# Altium schematic sheet 09-LogicNOR.SchDoc
size A4
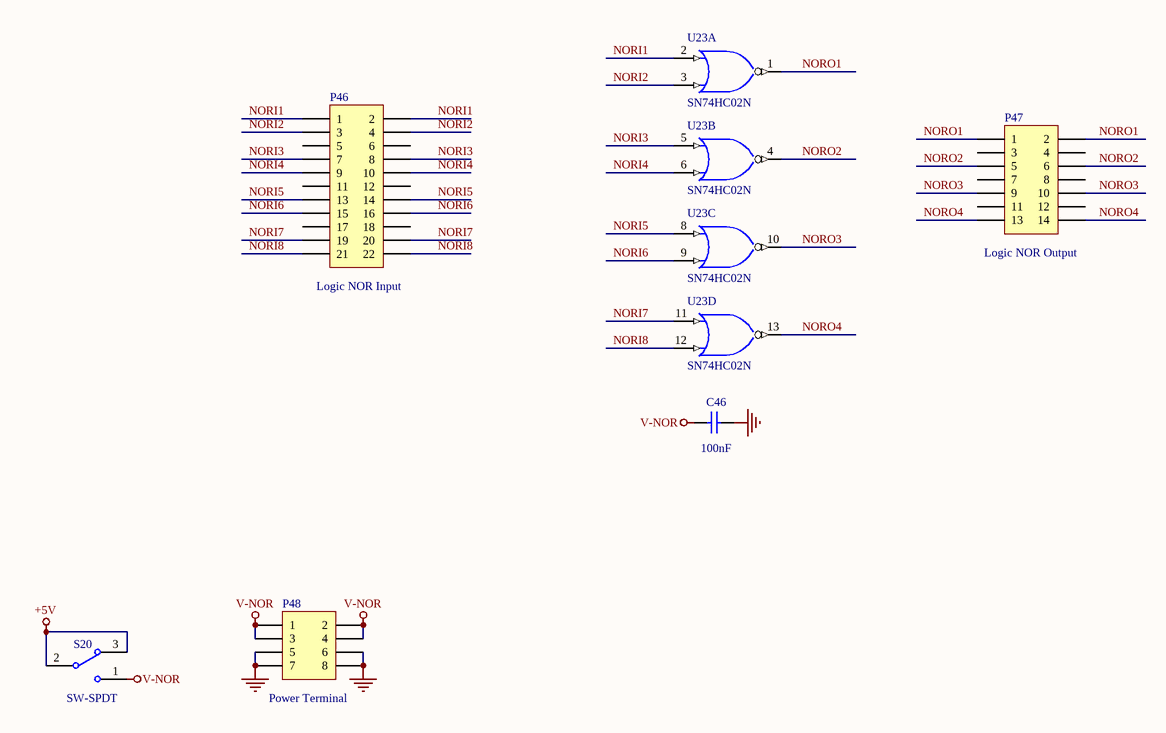
[diagram p0: 09-LogicNOR.SchDoc]

## Parts
C46  value 100nF  [C-0805]  (hidden comment: 104)
P46  value Logic NOR Input  [HDR2X11]  (hidden comment: Header 11X2)
P47  value Logic NOR Output  [HDR2X7]  (hidden comment: H7X2)
P48  Publisher: Power Terminal  [HDR2X4]  (hidden comment: Header 4X2)
S20  SW-SPDT  [SW-DIP1SMD]
U23  SN74HC02N  [SK-DIP14-300]  (parts A,B,C,D of 4)

## Nets
+5V: S20.2 S20.3
GND: C46.2 P48.5 P48.6 P48.7 P48.8 U23.7(GND)
V-NOR: C46.1 P48.1 P48.2 P48.3 P48.4 S20.1
VCC: U23.14(V-NOR)
NORI1: P46.1 P46.2 U23.2(A)
NORI2: P46.3 P46.4 U23.3(B)
NORI3: P46.7 P46.8 U23.5(A)
NORI4: P46.9 P46.10 U23.6(B)
NORI5: P46.13 P46.14 U23.8(A)
NORI6: P46.15 P46.16 U23.9(B)
NORI7: P46.19 P46.20 U23.11(A)
NORI8: P46.21 P46.22 U23.12(B)
NORO1: P47.1 P47.2 U23.1(Y)
NORO2: P47.5 P47.6 U23.4(Y)
NORO3: P47.9 P47.10 U23.10(Y)
NORO4: P47.13 P47.14 U23.13(Y)

Not connected (* = marked no-connect by the designer): P46 5 6 11 12 17 18; P47 3 4 7 8 11 12

## Library data of the parts
C46 = Cap: Capacitor; Published: 8-Jun-2000; LatestRevisionDate: 17-Jul-2002; LatestRevisionNote: Re-released for DXP Platform.; PackageReference: RAD-0.3; Publisher: Altium Limited; PackageDescription: Radial Cap, Thru-Hole; 2 Leads; 0.3 in Pin Spacing
P46 = Header 11X2: Header, 11-Pin, Dual row; LatestRevisionDate: 17-Jul-2002; LatestRevisionNote: Re-released for DXP Platform.
P47 = Header 7X2: Header, 7-Pin, Dual row; LatestRevisionDate: 17-Jul-2002; LatestRevisionNote: Re-released for DXP Platform.
P48 = Header 4X2: Header, 4-Pin, Dual row; LatestRevisionDate: 17-Jul-2002; LatestRevisionNote: Re-released for DXP Platform.
S20 = SW-SPDT: SPDT Subminiature Toggle Switch, Right Angle Mounting, Vertical Actuation; Published: 24-Mar-1999; LatestRevisionDate: 17-Dec-2003; LatestRevisionNote: Schematic revised, PCB Footprint replaced.; DatasheetVersion: 05-Dec-2000; PackageReference: TL36WW15050; Publisher: Altium Limited; PackageDescription: Switch; 4 Leads; ComponentLink1Description: Manufacturer Link; ComponentLink1URL: http://www.apem.com
U23 = SN74HC02N: Quadruple 2-Input Positive-NOR Gate; Published: 8-Jun-2000; LatestRevisionDate: 04-Mar-2005; LatestRevisionNote: Stylized 3D Model Added.; DatasheetVersion: May-1997; PackageVersion: Oct-1995; PackageReference: N014; Publisher: Altium Limited; PackageDescription: DIP; 14 Leads; Row Spacing 7.62 mm; Pitch 2.54 mm; ComponentLink1Description: Manufacturer Link; ComponentLink1URL: http://www.ti.com/; ComponentLink2Description: Datasheet; ComponentLink2URL: http://www-s.ti.com/sc/ds/sn74hc02.pdf